# EAGLE schematic LiPo Charger (EAGLE 9.4.2)
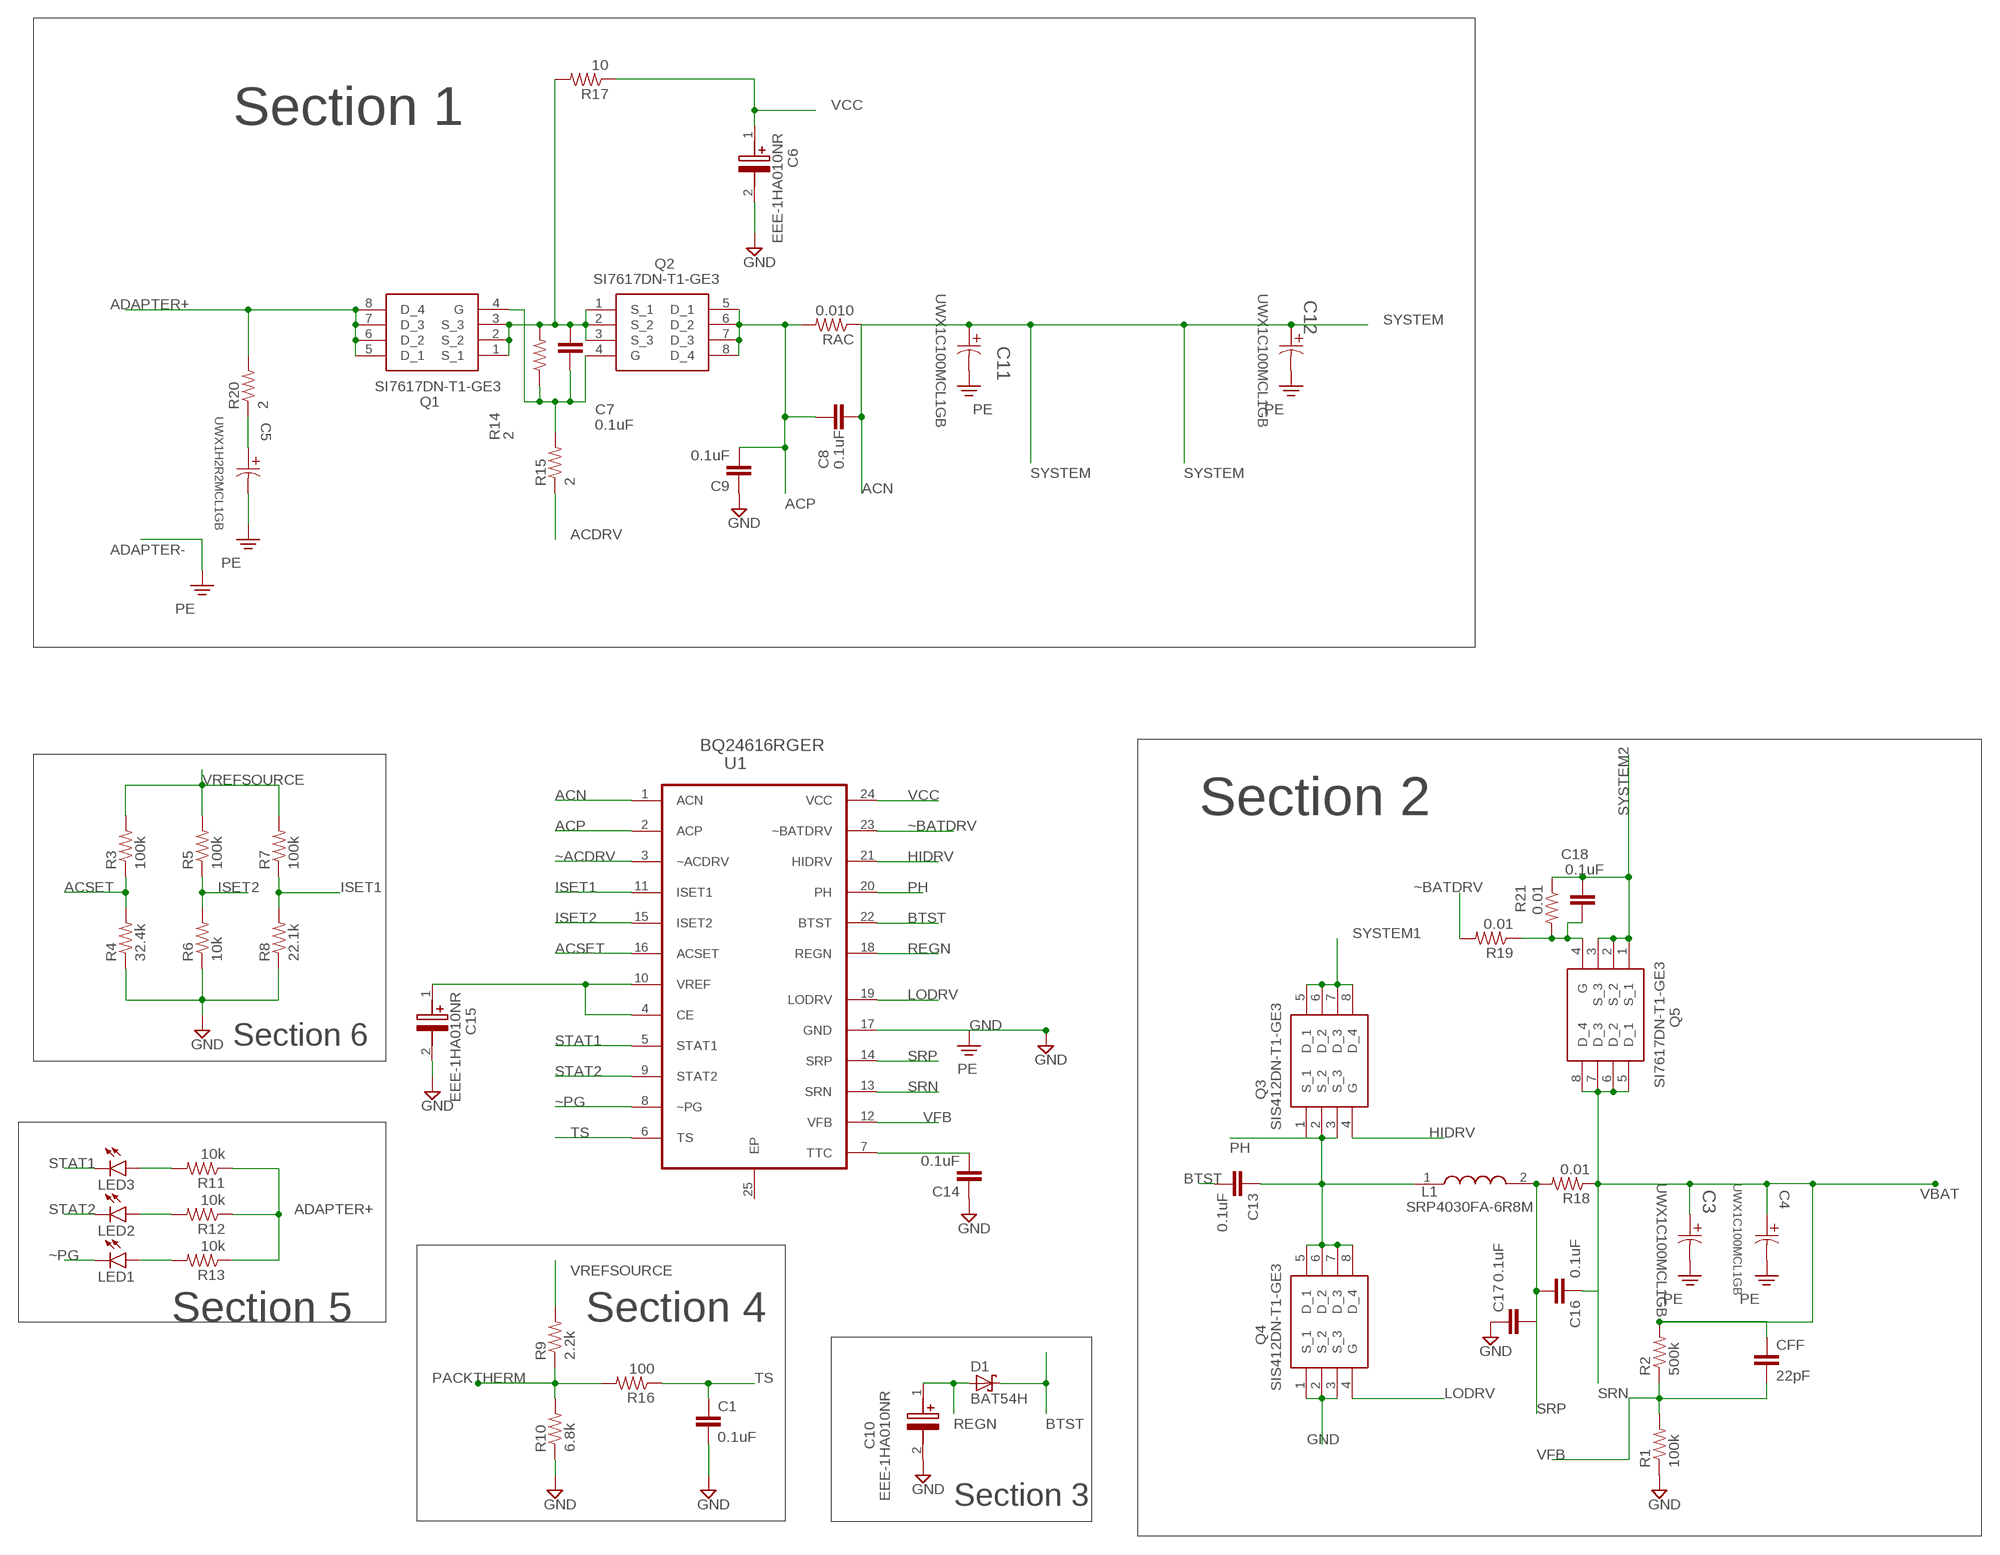
[diagram p0: schematic, sheet 1]

## Parts
C1  0.1uF  C-EUC0402  [C0402]
C3  UWX1C100MCL1GB  [PCAP_4X5.4-ELECT]
C4  UWX1C100MCL1GB  [PCAP_4X5.4-ELECT]
C5  UWX1H2R2MCL1GB  [PCAP_4X5.4-ELECT]
C6  EEE-1HA010NR  [CAPAE430X550N]
C7  0.1uF  C-EUC0402  [C0402]
C8  0.1uF  C-EUC0402  [C0402]
C9  0.1uF  C-EUC0402  [C0402]
C10  EEE-1HA010NR  [CAPAE430X550N]
C11  UWX1C100MCL1GB  [PCAP_4X5.4-ELECT]
C12  UWX1C100MCL1GB  [PCAP_4X5.4-ELECT]
C13  0.1uF  C-EUC0402  [C0402]
C14  0.1uF  C-EUC0402  [C0402]
C15  EEE-1HA010NR  [CAPAE430X550N]
C16  0.1uF  C-EUC0402  [C0402]
C17  0.1uF  C-EUC0402  [C0402]
C18  0.1uF  C-EUC0402  [C0402]
CFF  22pF  C-EUC0402  [C0402]
D1  BAT54H  [SOD123F]
L1  SRP4030FA-6R8M  [SRP4030FA3R3M]
LED1  LEDSML0805  [SML0805]
LED2  LEDSML0805  [SML0805]
LED3  LEDSML0805  [SML0805]
Q1  SI7617DN-T1-GE3  [SIS862DNT1GE3]
Q2  SI7617DN-T1-GE3  [SIS862DNT1GE3]
Q3  SIS412DN-T1-GE3  [POWERPAK-1212-8]
Q4  SIS412DN-T1-GE3  [POWERPAK-1212-8]
Q5  SI7617DN-T1-GE3  [SIS862DNT1GE3]
R1  100k  R-US_R0402  [R0402]
R2  500k  R-US_R0402  [R0402]
R3  100k  R-US_R0402  [R0402]
R4  32.4k  R-US_R0402  [R0402]
R5  100k  R-US_R0402  [R0402]
R6  10k  R-US_R0402  [R0402]
R7  100k  R-US_R0402  [R0402]
R8  22.1k  R-US_R0402  [R0402]
R9  2.2k  R-US_R0402  [R0402]
R10  6.8k  R-US_R0402  [R0402]
R11  10k  R-US_R0402  [R0402]
R12  10k  R-US_R0402  [R0402]
R13  10k  R-US_R0402  [R0402]
R14  2  R-US_R0402  [R0402]
R15  2  R-US_R0402  [R0402]
R16  100  R-US_R0402  [R0402]
R17  10  R-US_R0402  [R0402]
R18  0.01  R-US_R0402  [R0402]
R19  0.01  R-US_R0402  [R0402]
R20  2  R-US_R0402  [R0402]
R21  0.01  R-US_R0402  [R0402]
RAC  0.010  R-US_R0402  [R0402]
U1  BQ24616RGER  [QFN50P400X400X100-25N]

## Nets
ACDRV: R15.1
ACN: C8.2 U1.1(ACN)
ACP: C8.1 C9.2 Q2.5(D_1) Q2.6(D_2) Q2.7(D_3) Q2.8(D_4) RAC.2 U1.2(ACP)
ACSET: R3.1 R4.2 U1.16(ACSET)
ADAPTER+: Q1.5(D_1) Q1.6(D_2) Q1.7(D_3) Q1.8(D_4) R11.1 R12.1 R13.1 R20.2
ANOTHER: C13.1 L1.1 Q3.1(S_1) Q3.2(S_2) Q3.3(S_3) Q4.5(D_1) Q4.6(D_2) Q4.7(D_3) Q4.8(D_4)
BTST: C13.2 D1.1(K) U1.22(BTST)
GND: C1.2 C6.2(-) C9.1 C10.2(-) C14.1 C15.2(-) C17.1 Q4.1(S_1) Q4.2(S_2) Q4.3(S_3) R1.1 R4.1 R6.1 R8.1 R10.1 U1.17(GND) ; supply symbol labelled PE
HIDRV: Q3.4(G) U1.21(HIDRV)
ISET1: R7.1 R8.2 U1.11(ISET1)
ISET2: R5.1 R6.2 U1.15(ISET2)
LODRV: Q4.4(G) U1.19(LODRV)
N$2: LED3.A R11.2
N$3: C5.1 R20.1
N$4: C7.2 Q1.4(G) Q2.4(G) R14.1 R15.2
N$5: C7.1 Q1.1(S_1) Q1.2(S_2) Q1.3(S_3) Q2.1(S_1) Q2.2(S_2) Q2.3(S_3) R14.2 R17.2
N$6: LED2.A R12.2
N$7: C18.1 Q5.4(G) R19.1 R21.2
N$8: LED1.A R13.2
N$9: C14.2 U1.7(TTC)
PACKTHERM: R9.1 R10.2 R16.2
PE: C3.2 C4.2 C5.2 C11.2 C12.2
PH: U1.20(PH)
REGN: C10.1(+) D1.2(A) U1.18(REGN)
SRN: C16.1 U1.13(SRN)
SRP: C16.2 C17.2 L1.2 R18.2 U1.14(SRP)
STAT1: LED3.C U1.5(STAT1)
STAT2: LED2.C U1.9(STAT2)
SYSTEM: C11.1 C12.1 RAC.1
SYSTEM1: Q3.5(D_1) Q3.6(D_2) Q3.7(D_3) Q3.8(D_4)
SYSTEM2: C18.2 Q5.1(S_1) Q5.2(S_2) Q5.3(S_3) R21.1
TS: C1.1 R16.1 U1.6(TS)
VBAT: C3.1 C4.1 CFF.1 Q5.5(D_1) Q5.6(D_2) Q5.7(D_3) Q5.8(D_4) R2.2 R18.1
VCC: C6.1(+) R17.1 U1.24(VCC)
VFB: CFF.2 R1.2 R2.1 U1.12(VFB)
VREF: C15.1(+) U1.4(CE) U1.10(VREF)
VREFSOURCE: R3.2 R5.2 R7.2 R9.2
~ACDRV: U1.3(~ACDRV)
~BATDRV: R19.2 U1.23(~BATDRV)
~PG: LED1.C U1.8(~PG)
Unconnected: U1.25(EP)

## Notes on the sheet
- Section 1
- Section 2
- Section 6
- Section 5 | Section 4
- Section 3

## Library data of the parts
C1 C7-C9 C13 C14 C16-C18 CFF = rcl:C-EU: CAPACITOR, European symbol; SPICEPREFIX: C
C3 C4 C11 C12 = UWX1C100MCL1GB:UWX1C100MCL1GB: Capacitor 10uF; BUILT_BY: EMA_UL_Team; MANUFACTURER_PART_NUMBER: UWX1C100MCL1GB; VENDOR: Nichicon
C5 = UWX1H2R2MCL1GB:UWX1H2R2MCL1GB: Capacitor 2.2uF; BUILT_BY: EMA_UL_Team; MANUFACTURER_PART_NUMBER: UWX1H2R2MCL1GB; VENDOR: Nichicon
C6 C10 C15 = SamacSys_Parts:EEE-1HA010NR: PANASONIC - EEE-1HA010NR - ALUMINUM ELECTROLYTIC CAPACITOR, 1UF, 50V, 20%, SMD Source: Datasheet <https://componentsearchengine.com/Datasheets/1/EEE-1HA010NR.pdf>; DESCRIPTION: PANASONIC - EEE-1HA010NR - ALUMINUM ELECTROLYTIC CAPACITOR, 1UF, 50V, 20%, SMD; HEIGHT: 5.5mm; MANUFACTURER_NAME: Panasonic; MANUFACTURER_PART_NUMBER: EEE-1HA010NR; MOUSER_PART_NUMBER: 667-EEE-1HA010NR; MOUSER_PRICE-STOCK: https://www.mouser.com/Search/Refine.aspx?Keyword=667-EEE-1HA010NR
D1 = BAT54:BAT54: Schottky barrier diode Planar Schottky barrier diode encapsulated in small plastic SMD packages. Single diodes and double diodes with different pinning are available AAL Eindhoven MK; DESCRIPTION: Small Signal Schottky Diode, Single, 30 V, 200 mA, 800 mV, 600 mA, 150 C; DIGI-KEY_PART_NUMBER: BAT54FSCT-ND; DIGI-KEY_PURCHASE_URL: https://www.digikey.com/product-detail/en/on-semiconductor/BAT54/BAT54FSCT-ND/458928?utm_source=snapeda&utm_medium=aggregator&utm_campaign=symbol; MF: ON Semiconductor; MP: BAT54; PACKAGE: SOT-23-3 ON Semiconductor
L1 = SamacSys_Parts:SRP4030FA-6R8M: BOURNS - SRP4030FA-6R8M - INDUCTOR, SHLD, 6.8UH, 4A, AEC-Q200 Source: Datasheet <https://componentsearchengine.com/Datasheets/1/SRP4030FA-6R8M.pdf>; DESCRIPTION: BOURNS - SRP4030FA-6R8M - INDUCTOR, SHLD, 6.8UH, 4A, AEC-Q200; HEIGHT: 3mm; MANUFACTURER_NAME: Bourns; MANUFACTURER_PART_NUMBER: SRP4030FA-6R8M; MOUSER_PART_NUMBER: 652-SRP4030FA-6R8M; MOUSER_PRICE-STOCK: https://www.mouser.com/Search/Refine.aspx?Keyword=652-SRP4030FA-6R8M
LED1-LED3 = led:LED: LED OSRAM: - CHIPLED LG R971, LG N971, LY N971, LG Q971, LY Q971, LO R971, LY R971 LH N974, LH R974 LS Q976, LO Q976, LY Q976 LO Q996 - Hyper CHIPLED LW Q18S LB Q993, LB Q99A, LB R99A - SideLED LS A670, LO A670, LY A670, LG A670, LP A670 LB A673, LV A673, LT A673, LW A673 LH A674 LY A675 LS A676, LA A676, LO A676, LY A676, LW A676 LS A679, LY A679, LG A679 - Hyper Micro SIDELED® LS Y876, LA Y876, LO Y876, LY Y876 LT Y87S - SmartLED LW L88C, LW L88S LB L89C, LB L89S, LG L890 LS L89K, LO L89K, LY L89K LS L896, LA L896, LO L896, LY L896 - TOPLED LS T670, LO T670, LY T670, LG T670, LP T670 LSG T670, LSP T670, LSY T670, LOP T670, LYG T670 LG T671, LOG T671, LSG T671 LB T673, LV T673, LT T673, LW T673 LH T674 LS T676, LA T676, LO T676, LY T676, LB T676, LH T676, LSB T676, LW T676 LB T67C, LV T67C, LT T67C, LS T67K, LO T67K, LY T67K, LW E67C LS E67B, LA E67B, LO E67B, LY E67B, LB E67C, LV E67C, LT E67C LW T67C LS T679, LY T679, LG T679 LS T770, LO T770, LY T770, LG T770, LP T770 LB T773, LV T773, LT T773, LW T773 LH T774 LS E675, LA E675, LY E675, LS T675 LS T776, LA T776, LO T776, LY T776, LB T776 LHGB T686 LT T68C, LB T68C - Hyper Mini TOPLED® LB M676 - Mini TOPLED Santana® LG M470 LS M47K, LO M47K, LY M47K Source: http://www.osram.convergy.de LUXEON: - LUMILED® LXK2-PW12-R00, LXK2-PW12-S00, LXK2-PW14-U00, LXK2-PW14-V00 LXK2-PM12-R00, LXK2-PM12-S00, LXK2-PM14-U00 LXK2-PE12-Q00, LXK2-PE12-R00, LXK2-PE12-S00, LXK2-PE14-T00, LXK2-PE14-U00 LXK2-PB12-K00, LXK2-PB12-L00, LXK2-PB12-M00, LXK2-PB14-N00, LXK2-PB14-P00, LXK2-PB14-Q00 LXK2-PR12-L00, LXK2-PR12-M00, LXK2-PR14-Q00, LXK2-PR14-R00 LXK2-PD12-Q00, LXK2-PD12-R00, LXK2-PD12-S00 LXK2-PH12-R00, LXK2-PH12-S00 LXK2-PL12-P00, LXK2-PL12-Q00, LXK2-PL12-R00 Source: www.luxeon.com KINGBRIGHT: KA-3528ASYC Source: www.kingbright.com
Q1 Q2 Q5 = SamacSys_Parts:SI7617DN-T1-GE3: VISHAY - SI7617DN-T1-GE3 - MOSFET, P CH, 30V, 35A, POWERPAK Source: Datasheet <https://componentsearchengine.com/Datasheets/1/SI7617DN-T1-GE3.pdf>; DESCRIPTION: VISHAY - SI7617DN-T1-GE3 - MOSFET, P CH, 30V, 35A, POWERPAK; HEIGHT: mm; MANUFACTURER_NAME: Vishay; MANUFACTURER_PART_NUMBER: SI7617DN-T1-GE3; MOUSER_PART_NUMBER: 781-SI7617DN-GE3; MOUSER_PRICE-STOCK: https://www.mouser.com/Search/Refine.aspx?Keyword=781-SI7617DN-GE3
Q3 Q4 = SamacSys_Parts:SIS412DN-T1-GE3: VISHAY - SIS412DN-T1-GE3 - MOSFET, N-CH, 30V, 12A, POWERPAK8 Source: Datasheet <https://componentsearchengine.com/Datasheets/1/SIS412DN-T1-GE3.pdf>; DESCRIPTION: VISHAY - SIS412DN-T1-GE3 - MOSFET, N-CH, 30V, 12A, POWERPAK8; HEIGHT: mm; MANUFACTURER_NAME: Vishay; MANUFACTURER_PART_NUMBER: SIS412DN-T1-GE3; MOUSER_PART_NUMBER: 781-SIS412DN-T1-GE3; MOUSER_PRICE-STOCK: https://www.mouser.com/Search/Refine.aspx?Keyword=781-SIS412DN-T1-GE3
R1-R21 RAC = rcl:R-US_: RESISTOR, American symbol; SPICEPREFIX: R
U1 = BQ24616RGER:BQ24616RGER: JEITA Guideline Compatible Stand-Alone Synchronous Switch-Mode Li-Ion or Li-Polymer Battery Charger with System Power Selector and Low Iq; DESCRIPTION: JEITA Compatible Stand-Alone Synchronous Switch-Mode Li-Ion or Li-Polymer Battery Charger 24-VQFN -40 to 85; DIGI-KEY_PART_NUMBER: 296-48493-1-ND; DIGI-KEY_PURCHASE_URL: https://www.digikey.com/product-detail/en/texas-instruments/BQ24616RGER/296-48493-1-ND/8567537?utm_source=snapeda&utm_medium=aggregator&utm_campaign=symbol; MF: Texas Instruments; MP: BQ24616RGER; PACKAGE: VQFN-24 Texas Instruments